# EAGLE schematic configurator (EAGLE 7.5.0)
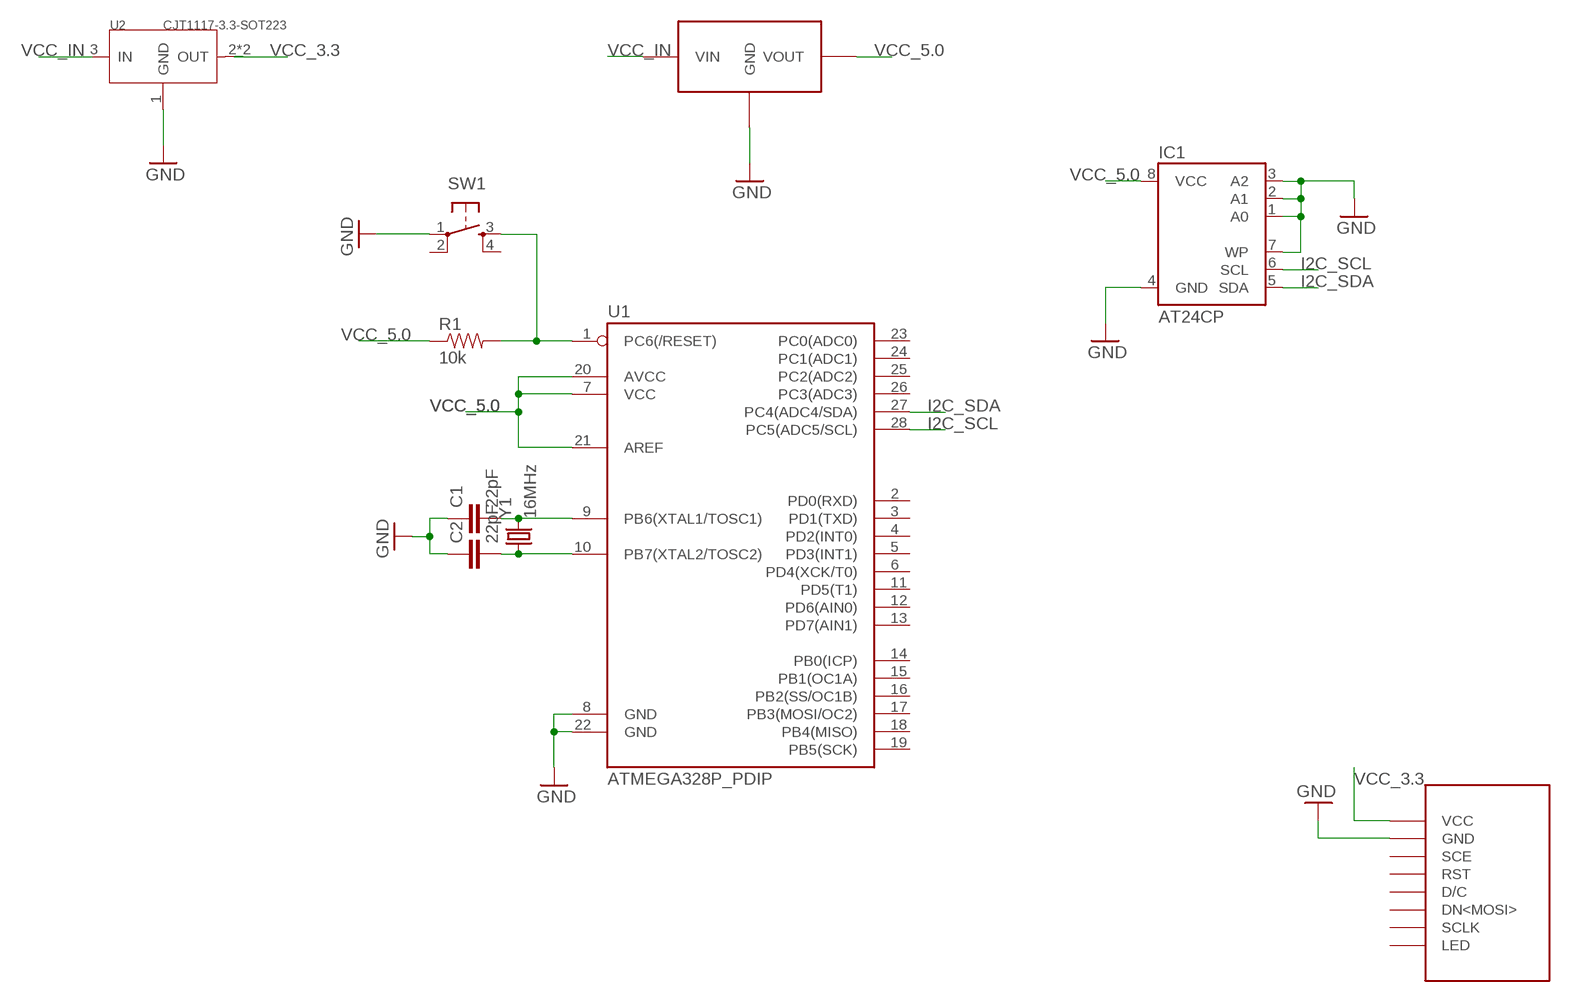
[diagram p0: schematic, sheet 1]

## Parts
C1  22pF  C5/3  [C5B3]
C2  22pF  C5/3  [C5B3]
IC1  AT24CP  [DIL08]
R1  10k  10KOHM-1/4W-1%(PTH)HORIZ  [AXIAL-0.3]
SW1  SWITCH_SPST_4_PIN  [TACTILE-SWITCH-SMD]
U1  ATMEGA328P_PDIP  [DIL28-3]
U2  CJT1117-3.3-SOT223  PMIC-CJT1117-3.3(SOT223)  [SOT-223]
U$1  NOKIA5110_1  [NOKIA_5110]
U$2  POLOLU_U3V12F5  [POLOLU_U3V12F5]
Y1  16MHz  CRYSTALHC49US  [HC49US]

## Nets
GND: C1.1 C2.1 IC1.1(A0) IC1.2(A1) IC1.3(A2) IC1.4(GND) IC1.7(WP) SW1.1 U1.8(GND) U1.22(GND) U2.1(GND) U$1.GND U$2.GND
I2C_SCL: IC1.6(SCL) U1.28(PC5(ADC5/SCL))
I2C_SDA: IC1.5(SDA) U1.27(PC4(ADC4/SDA))
N$1: C1.2 U1.9(PB6(XTAL1/TOSC1)) Y1.2
N$2: C2.2 U1.10(PB7(XTAL2/TOSC2)) Y1.1
N$3: R1.P$2 SW1.3 U1.1(PC6(/RESET))
VCC_3.3: U$1.VCC
VCC_5.0: IC1.8(VCC) R1.P$1 U1.7(VCC) U1.20(AVCC) U1.21(AREF) U$2.VOUT
VCC_IN: U$2.VIN
Unconnected: SW1.2 SW1.4 U1.2(PD0(RXD)) U1.3(PD1(TXD)) U1.4(PD2(INT0)) U1.5(PD3(INT1)) U1.6(PD4(XCK/T0)) U1.11(PD5(T1)) U1.12(PD6(AIN0)) U1.13(PD7(AIN1)) U1.14(PB0(ICP)) U1.15(PB1(OC1A)) U1.16(PB2(SS/OC1B)) U1.17(PB3(MOSI/OC2)) U1.18(PB4(MISO)) U1.19(PB5(SCK)) U1.23(PC0(ADC0)) U1.24(PC1(ADC1)) U1.25(PC2(ADC2)) U1.26(PC3(ADC3)) U2.2(OUT) U2.3(IN) U2.TER(OUT) U$1.D/C U$1.DN<MOSI> U$1.LED U$1.RST U$1.SCE U$1.SCLK

## Library data of the parts
C1 C2 = capacitor-wima:C: CAPACITOR naming: grid - package width
IC1 = atmel:AT24C*: 2-wire serial EEPROM; MPN: AT24C1024BW-SH-B; OC_FARNELL: 1362646; OC_NEWARK: 03P2044
R1 = SparkFun-Resistors:10KOHM-1/4W-1%(PTH): RES-12183; PROD_ID: RES-12183
SW1 = SparkFun-Electromechanical:SWITCH_SPST_4_PIN; PROD_ID: SWCH-08247
U1 = SparkFun-DigitalIC:ATMEGA328P_PDIP: uC used in the Arduino 32kb flash, 1k EEPROM, 2k SRAM This is the through-hole version of this chip.
U2 = Seeed-OPL-ic:PMIC-CJT1117-3.3(SOT223): 310030097; MPN: CJT1117-3.3
U$1 = personal:NOKIA5110_1
U$2 = personal:POLOLU_U3V12F5
Y1 = SparkFun-FreqCtrl:CRYSTAL: Various standard crystals. Proven footprints.